# EAGLE design UV_exposure_v1.0 (EAGLE 7.5.0)
Circuit for UV exposure unit.
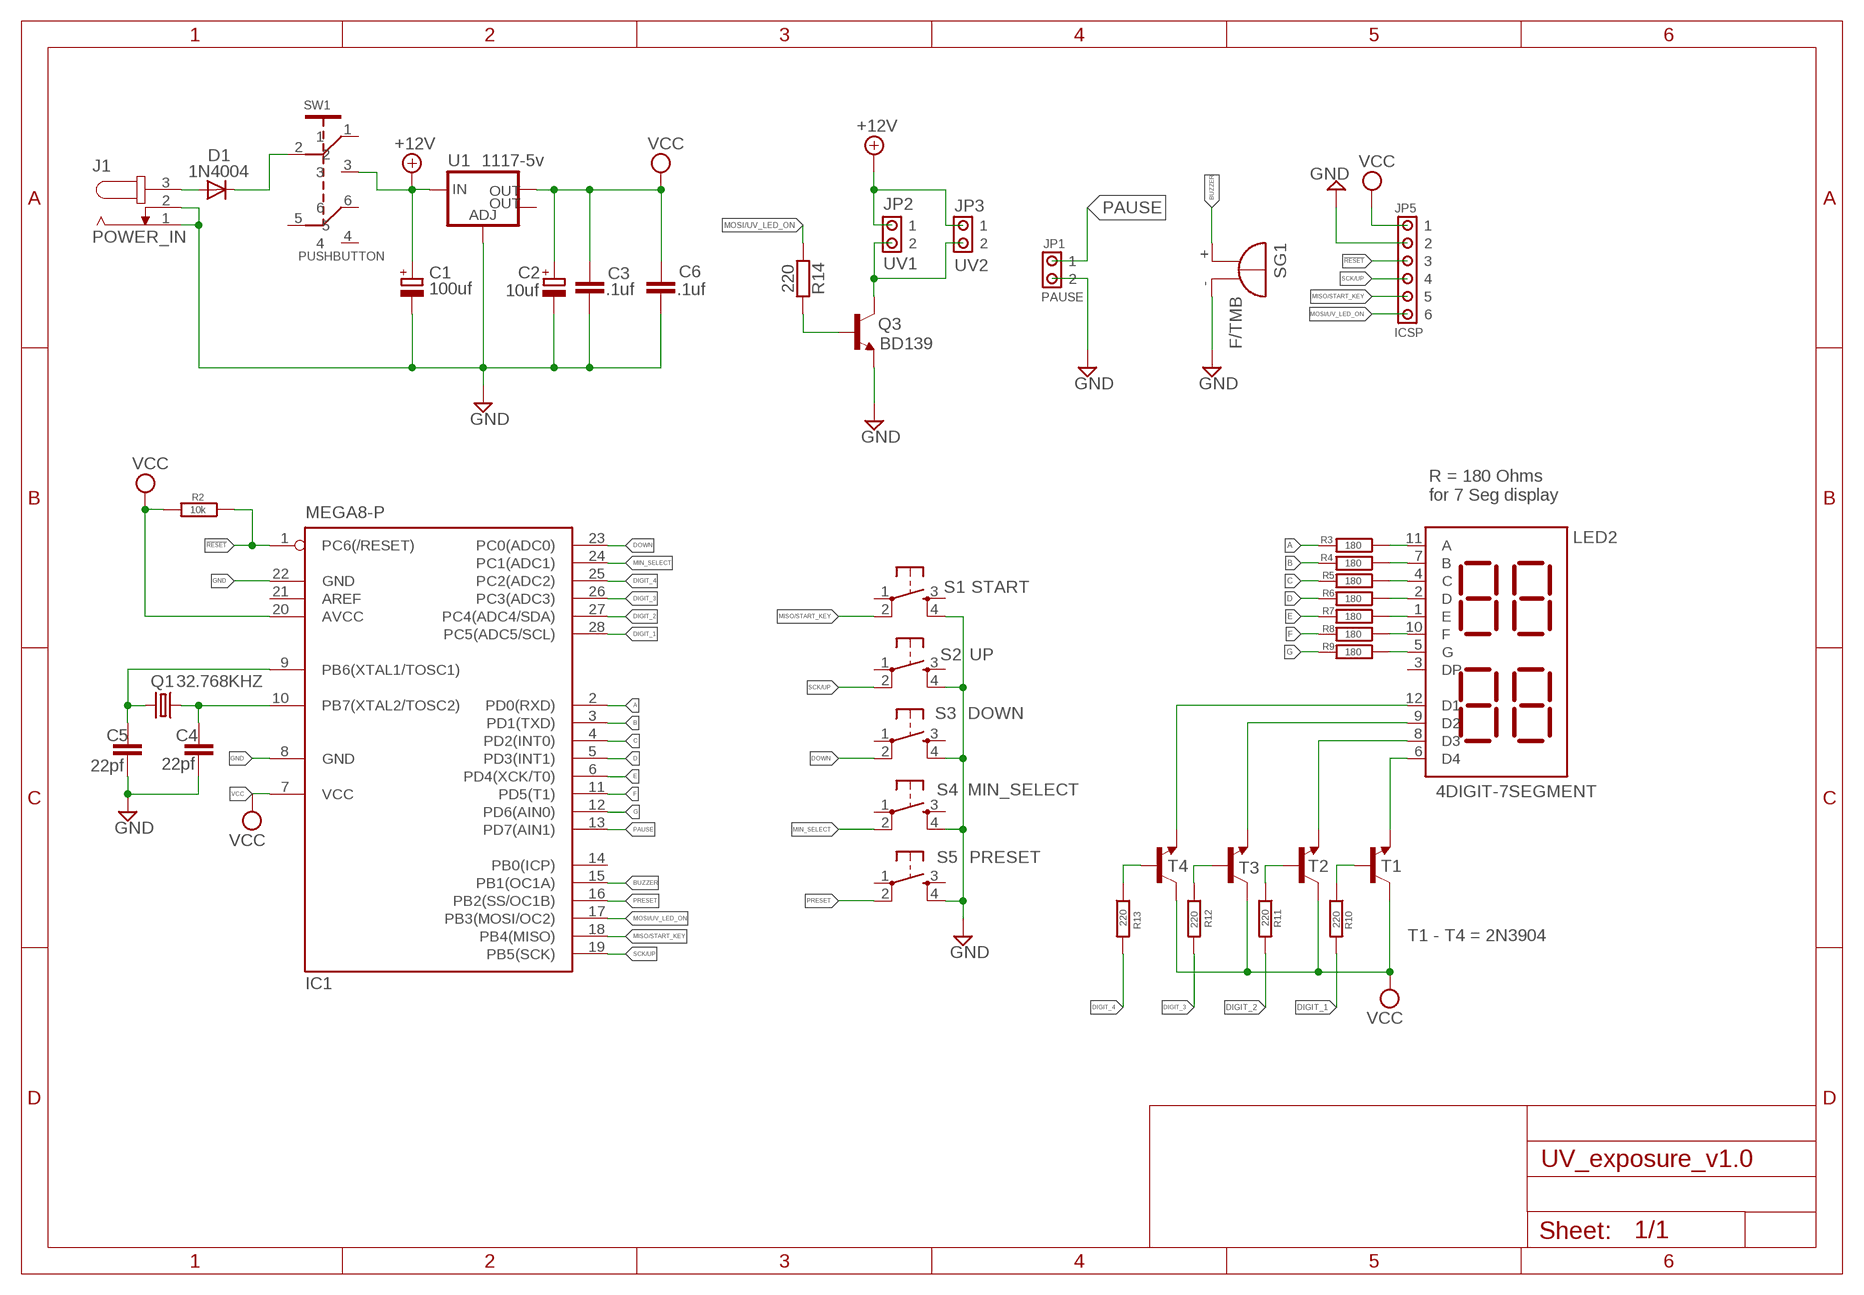
[diagram p0: schematic, sheet 1]

## Parts
C1  100uf  CPOL-EUUD-6,3X7,7  [UD-6,3X7,7_NICHICON]
C2  10uf  CPOL-EU153CLV-0505  [153CLV-0505]
C3  .1uf  C-EUC0805  [C0805]
C4  22pf  C-EUC0805  [C0805]
C5  22pf  C-EUC0805  [C0805]
C6  .1uf  C-EUC0805  [C0805]
D1  1N4004  DIODE-DO214AA  [DO214AA]
IC1  MEGA8-P  [DIL28-3]
J1  POWER_IN  JACK-PLUG1  [SPC4078]
JP1  PAUSE  PIN_HDR_2X1::LONG  [1X2_LONG]
JP2  UV1  PIN_HDR_2X1::LONG  [1X2_LONG]
JP3  UV2  PIN_HDR_2X1::LONG  [1X2_LONG]
JP5  ICSP  PIN_HDR_6X1  [1X6_LONG]
LED2  4DIGIT-7SEGMENT  [4DIGIT-7SEGMENT]
Q1  32.768KHZ  CRYSTALTC26V  [TC26V]
Q3  BD139  [TO126]
R2  10k  R-EU_R1206W  [R1206W]
R3  180  R-EU_R1206W  [R1206W]
R4  180  R-EU_R1206W  [R1206W]
R5  180  R-EU_R1206W  [R1206W]
R6  180  R-EU_R1206W  [R1206W]
R7  180  R-EU_R1206W  [R1206W]
R8  180  R-EU_R1206W  [R1206W]
R9  180  R-EU_R1206W  [R1206W]
R10  220  R-EU_R1206W  [R1206W]
R11  220  R-EU_R1206W  [R1206W]
R12  220  R-EU_R1206W  [R1206W]
R13  220  R-EU_R1206W  [R1206W]
R14  220  R-EU_R1206W  [R1206W]
S1  START  10-XX-SWITCH  [B3F-10XX]
S2  UP  10-XX-SWITCH  [B3F-10XX]
S3  DOWN  10-XX-SWITCH  [B3F-10XX]
S4  MIN_SELECT  10-XX-SWITCH  [B3F-10XX]
S5  PRESET  10-XX-SWITCH  [B3F-10XX]
SG1  F/TMB  [F/TMB]
SW1  PUSHBUTTON  [SPDT-6PIN]
T1  2N3904  MMBT3904LT1-NPN-SOT23-BEC  [SOT23-BEC]
T2  2N3904  MMBT3904LT1-NPN-SOT23-BEC  [SOT23-BEC]
T3  2N3904  MMBT3904LT1-NPN-SOT23-BEC  [SOT23-BEC]
T4  2N3904  MMBT3904LT1-NPN-SOT23-BEC  [SOT23-BEC]
U1  1117-5v  V_REG_LM1117SOT223  [SOT223]

## Nets
!RESET: IC1.1(PC6(/RESET)) JP5.3 R2.1
+12V: C1.+ JP2.1 JP3.1 SW1.3 U1.3(IN)
A: IC1.2(PD0(RXD)) R3.2
B: IC1.3(PD1(TXD)) R4.2
BUZZER: IC1.15(PB1(OC1A)) SG1.+
C: IC1.4(PD2(INT0)) R5.2
D: IC1.5(PD3(INT1)) R6.2
DIGIT_1: IC1.28(PC5(ADC5/SCL)) R10.2
DIGIT_2: IC1.27(PC4(ADC4/SDA)) R11.2
DIGIT_3: IC1.26(PC3(ADC3)) R12.2
DIGIT_4: IC1.25(PC2(ADC2)) R13.2
DOWN: IC1.23(PC0(ADC0)) S3.2(P1)
E: IC1.6(PD4(XCK/T0)) R7.2
F: IC1.11(PD5(T1)) R8.2
G: IC1.12(PD6(AIN0)) R9.2
GND: C1.- C2.- C3.2 C4.2 C5.2 C6.2 IC1.8(GND) IC1.22(GND) J1.1 J1.2 JP1.2 JP5.2 Q3.1(E) S1.4(S1) S2.4(S1) S3.4(S1) S4.4(S1) S5.4(S1) SG1.- U1.1(ADJ)
MIN_SELECT: IC1.24(PC1(ADC1)) S4.2(P1)
MISO/START_KEY: IC1.18(PB4(MISO)) JP5.5 S1.2(P1)
MOSI/UV_LED_ON: IC1.17(PB3(MOSI/OC2)) JP5.6 R14.2
N$2: D1.A J1.3
N$3: C4.1 IC1.10(PB7(XTAL2/TOSC2)) Q1.1
N$4: D1.C SW1.2
N$5: C5.1 IC1.9(PB6(XTAL1/TOSC1)) Q1.2
N$6: LED2.11(A) R3.1
N$7: LED2.7(B) R4.1
N$8: LED2.4(C) R5.1
N$9: LED2.2(D) R6.1
N$10: LED2.1(E) R7.1
N$11: LED2.10(F) R8.1
N$12: LED2.5(G) R9.1
N$13: LED2.6(D4) T1.E
N$14: R10.1 T1.B
N$15: LED2.8(D3) T2.E
N$16: LED2.9(D2) T3.E
N$17: LED2.12(D1) T4.E
N$18: R13.1 T4.B
N$19: R12.1 T3.B
N$20: R11.1 T2.B
N$21: Q3.3(B) R14.1
N$23: JP2.2 JP3.2 Q3.2(C)
PAUSE: IC1.13(PD7(AIN1)) JP1.1
PRESET: IC1.16(PB2(SS/OC1B)) S5.2(P1)
SCK/UP: IC1.19(PB5(SCK)) JP5.4 S2.2(P1)
VCC: C2.+ C3.1 C6.1 IC1.7(VCC) IC1.20(AVCC) JP5.1 R2.2 T1.C T2.C T3.C T4.C U1.2(OUT)
Unconnected: IC1.14(PB0(ICP)) IC1.21(AREF) LED2.3(DP) S1.1(P) S1.3(S) S2.1(P) S2.3(S) S3.1(P) S3.3(S) S4.1(P) S4.3(S) S5.1(P) S5.3(S) SW1.1 SW1.4 SW1.5 SW1.6 U1.4(OUT)

## Notes on the sheet
- R = 180 Ohms
  for 7 Seg display
- T1 - T4 = 2N3904

## Library data of the parts
C1 C2 = rcl:CPOL-EU: POLARIZED CAPACITOR, European symbol
C3-C6 = rcl:C-EU: CAPACITOR, European symbol
D1 = diode:DIODE-: DIODE
IC1 = atmel:MEGA8-P: MICROCONTROLLER 8 Kbytes FLASH, 1 kbytes SRAM, 512 bytes EEPROM, USART, 4-channel 10 bit ADC, 2-channel 8 bit ADC Pin compatible with Atmega48, ATMega88, ATMega168 Source: avr.lbr; OC_FARNELL: unknown; OC_NEWARK: unknown
J1 = con-jack:JACK-PLUG: DC POWER JACK Power Jack, DC, Right Angle, Through Hole, Rated 5A at 16VDC, PC Terminals Distributor: Farnell (www.Farnell.de) Drawing: 84N1161.pdf / 84N1162.pdf Manufacturer: SPC Technology (www.spctechnology.com) Type: SPC4077 / SPC 4078; OC_FARNELL: unknown; OC_NEWARK: unknown
JP1-JP3 = pinheaders:PIN_HDR_2X1: 2x1 pin header with different pad shapes.
JP5 = pinheaders:PIN_HDR_6X1
LED2 = mylib_v10:4DIGIT-7SEGMENT
Q1 = crystal:CRYSTAL: CRYSTAL; OC_FARNELL: unknown; OC_NEWARK: unknown
Q3 = transistor-npn:BD139*: NPN Transistor
R2-R14 = rcl:R-EU_: RESISTOR, European symbol
S1-S5 = my_library:10-XX-SWITCH: OMRON SWITCH
SG1 = buzzer:F/TMB: BUZZER Source: Buerklin; OC_FARNELL: unknown; OC_NEWARK: unknown
SW1 = switches:PUSHBUTTON
T1-T4 = transistor:*-NPN-: NPN Transistror BF959 corrected 2008.03.06
U1 = SparkFun-PowerIC:V_REG_LM1117: Voltage Regulator LM1117 Standard adjustable voltage regulator but in SMD form. Spark Fun Electronics SKU : COM-00595; PROD_ID: VREG-08170

## Net classes
0 default: width 0.406 mm, drill 0.6 mm, clearance 0.254 mm

## Board
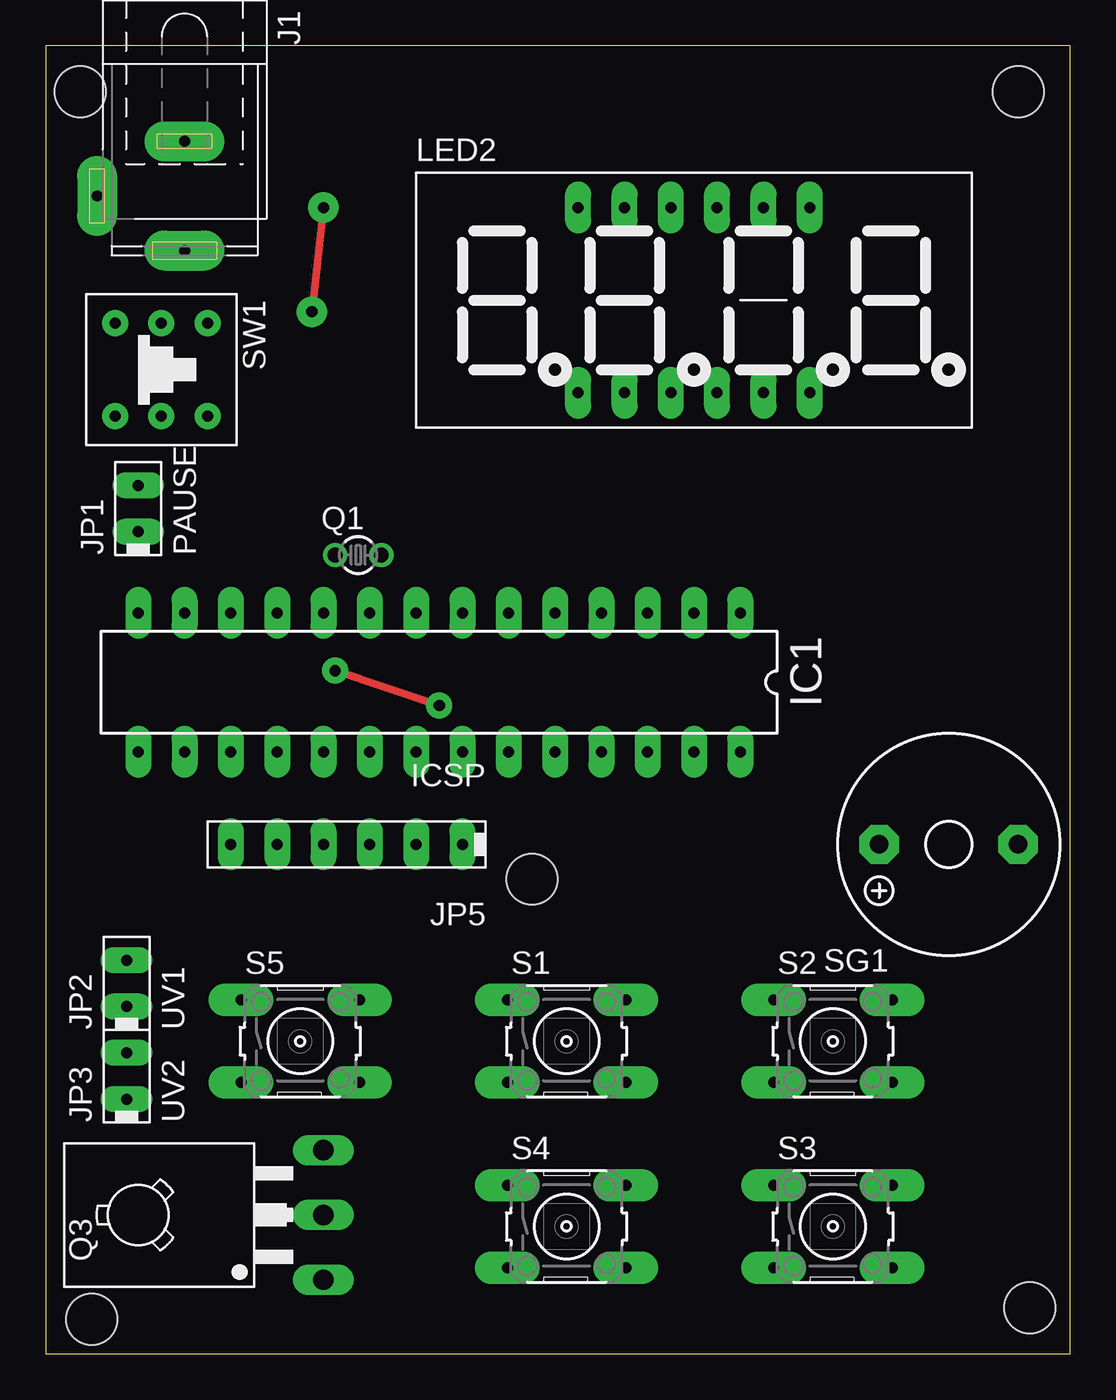
[diagram p1: board, top side]
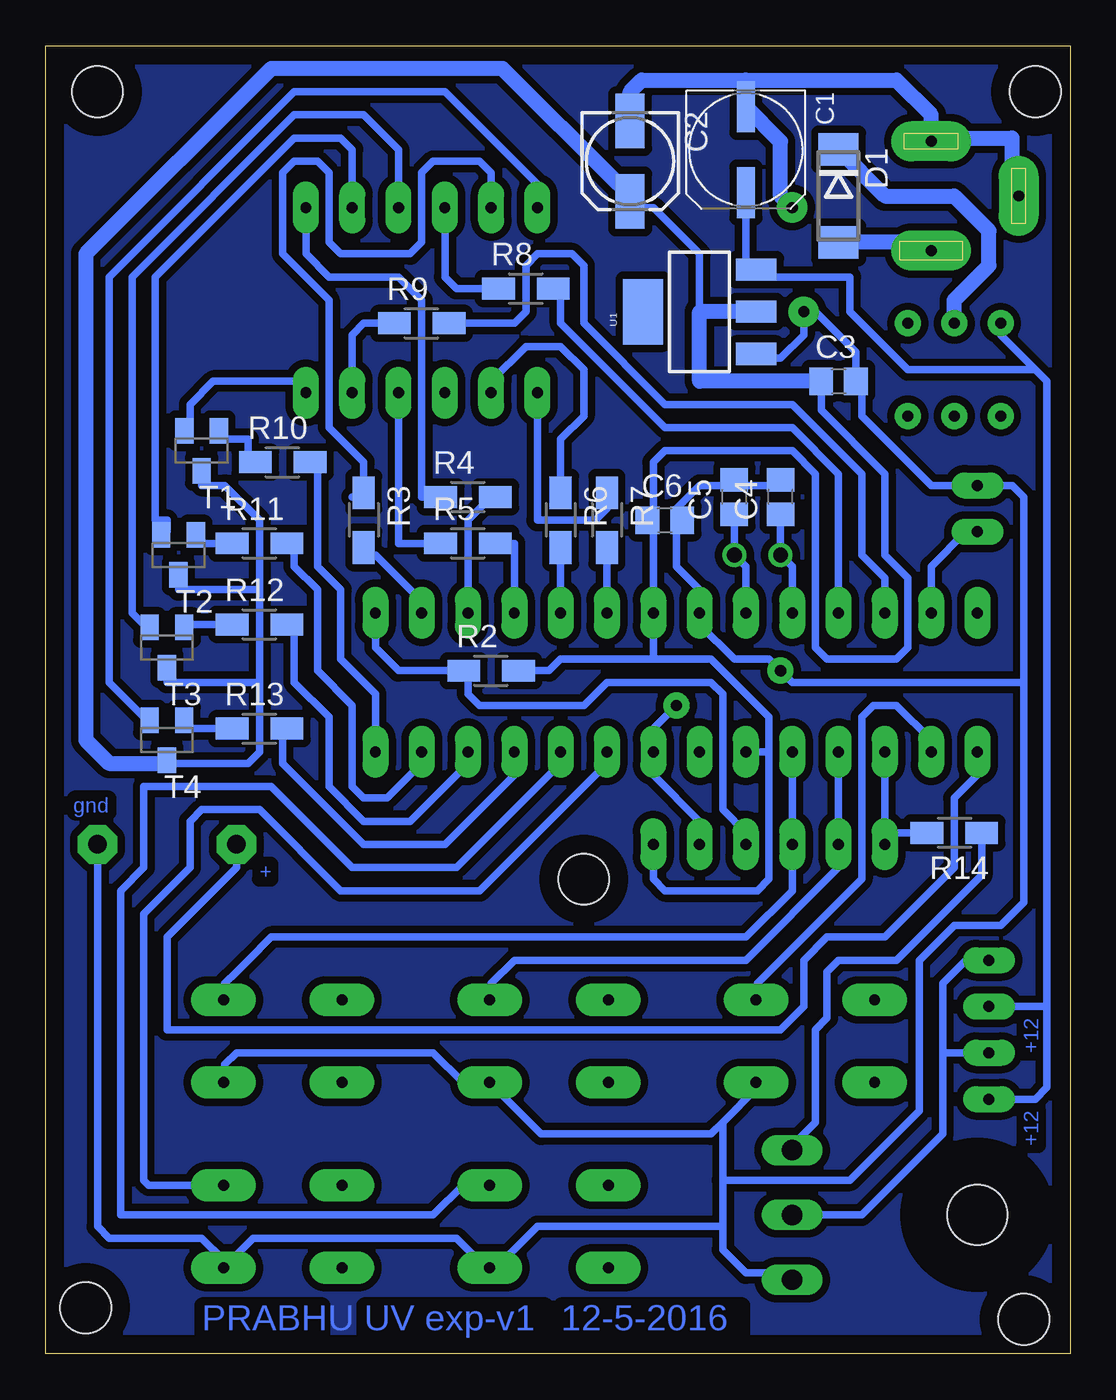
[diagram p2: board, bottom side, seen from below]

Size 56.19 x 71.75 mm. Coordinates in mm from the lower left corner, seen from the top.
Outline: 0,0 56.19,0 56.19,71.75 0,71.75 0,0
Copper layers (1*16): Top 0.035mm / dielectric 1.5mm / Bottom 0.035mm
Design rules "default *": minimum track width 10mil, minimum drill 0.6mm, track to track 8mil, track to pad 8mil, pad to pad 8mil, via to via 8mil, smd to smd 8mil, copper to edge 40mil, drill to drill 8mil, minimum pad ring 10mil, minimum via ring 8mil, stop-mask expansion 4mil, vias tented up to drill 0mil, thermal gap 10mil
Holes 2.8 mm at 26.67,26.04 53.98,2.54 2.54,1.91 53.34,69.22 1.91,69.22

### Footprints (pad centres in the part's own frame; a part is rotated, then mirrored left to right if it is on the bottom)
UD-6,3X7,7_NICHICON = smd 2.8 x 1: + 2.35,0; - -2.35,0
153CLV-0505 = smd 3 x 1.6: + 2.2,0; - -2.2,0
C0805 = smd 1.3 x 1.5: 1 -0.95,0; 2 0.95,0
DO214AA = smd 1.8 x 2.2: A 2.55,0; C -2.55,0
DIL28-3 = drill 0.6 pad 1.422 long: 1 -16.51,-3.81; 2 -13.97,-3.81; 3 -11.43,-3.81; 4 -8.89,-3.81; 5 -6.35,-3.81; 6 -3.81,-3.81; 7 -1.27,-3.81; 8 1.27,-3.81; 9 3.81,-3.81; 10 6.35,-3.81; 11 8.89,-3.81; 12 11.43,-3.81; 13 13.97,-3.81; 14 16.51,-3.81; 15 16.51,3.81; 16 13.97,3.81; 17 11.43,3.81; 18 8.89,3.81; 19 6.35,3.81; 20 3.81,3.81; 21 1.27,3.81; 22 -1.27,3.81; 23 -3.81,3.81; 24 -6.35,3.81; 25 -8.89,3.81; 26 -11.43,3.81; 27 -13.97,3.81; 28 -16.51,3.81
SPC4078 = drill 0.6 pad 2.184 long: 1 -3,0; 2 0,-4.8; 3 3,0
1X2_LONG = drill 0.6 pad 1.422 long: 1 0,0; 2 2.54,0
1X6_LONG = drill 0.6 pad 1.422 long: 1 -5.08,0; 2 -2.54,0; 3 0,0; 4 2.54,0; 5 5.08,0; 6 7.62,0
4DIGIT-7SEGMENT = drill 0.6 pad 1.422 long: 1 -6.35,-5.08; 2 -3.81,-5.08; 3 -1.27,-5.08; 4 1.27,-5.08; 5 3.81,-5.08; 6 6.35,-5.08; 7 6.35,5.08; 8 3.81,5.08; 9 1.27,5.08; 10 -1.27,5.08; 11 -3.81,5.08; 12 -6.35,5.08
TC26V = drill 0.813: 1 -1.27,0; 2 1.27,0
TO126 = drill 1.118 pad 1.422 long: 1 -3.556,-5.08; 2 0,-5.08; 3 3.556,-5.08 | hole 3.302: 0,5.08
R1206W = smd 1.8 x 1.2: 1 -1.499,0; 2 1.499,0
B3F-10XX = drill 0.6 pad 1.778 long: 1 -3.251,2.261; 2 3.251,2.261; 3 -3.251,-2.261; 4 3.251,-2.261
F/TMB = drill 1.016 pad 2.159 octagon: + 3.81,0; - -3.81,0
SPDT-6PIN = drill 0.6 pad 1.422: 1 -2.54,2.54; 2 -2.54,0; 3 -2.54,-2.54; 4 2.54,-2.54; 5 2.54,0; 6 2.54,2.54
SOT23-BEC = smd 1 x 1.4: B -0.95,-1.1; C 0,1.1; E 0.95,-1.1
SOT223 = smd 1.219 x 2.235: 1 -2.311,-3.099; 2 0,-3.099; 3 2.311,-3.099 | smd 3.6 x 2.2: 4 0,3.099

### Placement (x,y rotation side)
C1  17.78,66.04 270 bottom
C2  24.13,65.41 270 bottom
C3  12.7,53.34 0 bottom
C4  15.88,46.99 90 bottom
C5  18.41,46.99 90 bottom
C6  22.23,45.72 0 bottom
D1  12.7,63.5 270 bottom
IC1  21.59,36.83 180 top
J1  7.62,63.5 270 top
JP1  5.08,45.09 90 top
JP2  4.45,19.05 90 top
JP3  4.45,13.97 90 top
JP5  17.78,27.94 180 top
LED2  35.56,57.78 0 top
Q1  17.14,43.81 0 top
Q3  10.16,7.62 90 top
R2  31.75,37.47 0 bottom
R3  38.73,45.72 270 bottom
R4  33.02,46.99 0 bottom
R5  33.02,44.45 0 bottom
R6  27.94,45.72 270 bottom
R7  25.4,45.72 270 bottom
R8  29.84,58.42 0 bottom
R9  35.56,56.52 0 bottom
R10  43.18,48.9 0 bottom
R11  44.45,44.45 0 bottom
R12  44.45,40.01 0 bottom
R13  44.45,34.29 0 bottom
R14  6.35,28.57 180 bottom
S1  28.57,17.14 0 top
S2  43.18,17.14 0 top
S3  43.18,6.99 0 top
S4  28.57,6.99 0 top
S5  13.97,17.14 0 top
SG1  49.53,27.94 180 top
SW1  6.35,53.98 270 top
T1  47.62,49.53 180 bottom
T2  48.9,43.81 180 bottom
T3  49.53,38.73 180 bottom
T4  49.53,33.66 180 bottom
U1  20.32,57.15 90 bottom

### Tracks (layer width: path | path; a pad name or v marks a point on that pad's centre or on a via)
!RESET
  Bottom 0.406: JP5.3 17.78,28.57 19.05,29.84 19.05,36.2 19.68,36.83 25.4,36.83 26.67,35.56 32.38,35.56 33.02,36.2 33.02,37.24 R2.1 | IC1.1 38.1,38.73 36.83,37.47 R2.1 | 33.02,37.47 R2.1
+12V
  Bottom 0.406: 1.91,53.98 3.81,55.88 SW1.3 | 1.27,19.05 1.27,14.61 1.91,13.97 JP3.1 | 1.27,19.05 1.27,53.34 1.59,53.66 1.91,53.98 | 17.59,63.5 C1.+ 17.78,59.69 U1.3 | 17.14,59.69 U1.3 | U1.3 16.82,59.05 12.06,59.05 12.06,57.15 8.89,53.98 1.91,53.98 | JP2.1 1.27,19.05
A
  Bottom 0.406: IC1.2 35.56,41.27 38.1,43.81 38.73,43.81 R3.2
B
  Bottom 0.406: IC1.3 33.02,45.72 31.75,46.99 R4.2
BUZZER
  Bottom 0.406: SG1.+ 45.72,26.67 49.53,22.86 49.53,17.78 15.88,17.78 14.61,19.05 14.61,21.59 13.34,22.86 10.16,22.86 6.35,26.67 6.35,30.48 5.08,31.75 IC1.15
C
  Bottom 0.406: R5.2 30.48,44.45 IC1.4
D
  Bottom 0.406: IC1.5 R6.2
DIGIT_1
  Bottom 0.406: IC1.28 38.1,36.2 40.01,38.1 40.01,41.91 41.27,43.18 41.27,48.9 R10.2
DIGIT_2
  Bottom 0.406: R11.2 42.55,44.45 42.55,43.18 41.27,41.91 41.27,37.47 39.37,35.56 39.37,31.11 38.73,30.48 37.47,30.48 35.56,32.38 IC1.27
DIGIT_3
  Bottom 0.406: IC1.26 33.02,32.38 36.2,29.21 38.73,29.21 40.64,31.11 40.64,34.92 42.55,36.83 42.55,40.01 R12.2
DIGIT_4
  Bottom 0.406: IC1.25 30.48,31.75 34.29,27.94 38.73,27.94 43.18,32.38 43.18,34.06 R13.2
DOWN
  Bottom 0.406: IC1.23 25.4,32.38 32.38,25.4 40.01,25.4 44.45,29.84 47.62,29.84 48.26,29.21 48.26,26.67 50.8,24.13 50.8,9.53 50.52,9.25 S3.2
E
  Bottom 0.406: IC1.6 R7.2
F
  Bottom 0.406: IC1.11 12.7,48.26 15.24,50.8 22.23,50.8 27.94,56.52 27.94,58.42 R8.2
G
  Bottom 0.406: R9.2 30.48,56.52 29.84,57.15 29.84,59.69 29.21,60.33 27.3,60.33 26.67,59.69 26.67,56.52 22.23,52.07 15.24,52.07 11.43,48.26 11.43,43.81 10.16,42.55 IC1.12
GND  (via drill 0.61 pad 1.42, 0.61 pad 1.68)
  Top 0.406: v21.59,35.56 v15.88,37.47 | v14.61,57.15 v15.24,62.87
  Bottom 0.406: 19.05,12.7 17.14,14.61 S5.4 | 19.05,12.7 19.68,12.06 29.01,12.06 S1.4 33.3,14.88 34.92,16.51 45.72,16.51 46.35,15.88 46.35,14.96 S2.4 | Q3.1 15.24,4.45 17.78,4.45 19.05,5.71 19.05,6.99 | 19.05,12.7 19.05,9.53 | 19.05,9.53 19.05,6.99 | 19.05,9.53 12.06,9.53 8.26,13.34 8.26,21.59 6.35,23.5 3.81,23.5 2.54,24.77 2.54,36.83 | 2.54,36.83 2.54,46.99 3.17,47.62 JP1.2 7.62,47.62 11.43,51.44 11.43,53.02 C3.2 11.75,54.93 13.97,57.15 v14.61,57.15 14.61,55.88 15.88,54.61 16.99,54.61 U1.1 17.14,54.61 | JP5.2 20.32,29.21 22.86,31.75 IC1.22 22.86,34.29 v21.59,35.56 | 3.17,63.5 J1.2 | 7.62,66.67 J1.1 | C1.- 17.78,69.85 | 2.54,36.83 15.24,36.83 v15.88,37.47 16.51,38.1 18.41,38.1 20.32,40.01 IC1.8 20.32,41.91 21.59,43.18 21.59,45.72 | 21.59,45.72 21.59,46.35 20.32,47.62 18.41,47.62 | 21.59,45.72 C6.2 | 18.41,47.62 C5.2 | 18.41,47.62 15.88,47.62 C4.2 | SG1.- 53.34,6.99 52.7,6.35 47.62,6.35 46.43,5.16 S3.4 | 46.35,4.65 S3.4 | 19.05,6.99 29.21,6.99 31.47,4.72 S4.4 32.03,4.72 33.66,6.35 44.81,6.35 S3.4
  Bottom 0.813: 3.17,63.5 3.17,66.67 7.62,66.67 7.62,67.94 9.53,69.85 17.78,69.85 23.5,69.85 24.13,69.22 C2.- | v15.24,62.87 15.88,63.5 15.88,66.48 C1.-
MIN_SELECT
  Bottom 0.406: IC1.24 27.94,32.38 33.66,26.67 39.37,26.67 43.81,31.11 50.8,31.11 50.8,26.67 52.07,25.4 52.07,7.62 34.92,7.62 33.3,9.25 S4.2
MISO/START_KEY
  Bottom 0.406: IC1.18 JP5.5 12.7,26.67 17.78,21.59 30.48,21.59 31.75,20.32 31.75,19.48 S1.2
MOSI/UV_LED_ON
  Bottom 0.406: JP5.6 10.16,28.57 | 10.16,28.57 IC1.17 | R14.2 10.16,28.57
N$1
  pour Bottom (isolate 0.406): 0,0 55.88,0 55.88,71.75 0,71.75
N$2
  Bottom 0.406: D1.A
  Bottom 0.813: D1.A 7.62,60.96 J1.3
N$3
  Bottom 0.406: IC1.10 15.24,43.18 Q1.1 C4.1
N$4
  Bottom 0.406: D1.C
  Bottom 0.813: SW1.2 6.35,57.78 4.45,59.69 4.45,61.59 6.35,63.5 10.15,63.5 D1.C
N$5
  Bottom 0.406: IC1.9 17.78,43.18 Q1.2 C5.1
N$6
  Bottom 0.406: 31.75,63.5 LED2.11 31.75,64.77 32.38,65.41 34.92,65.41 35.56,64.77 35.56,60.96 36.2,60.33 40.01,60.33 40.64,60.96 40.64,64.77 41.27,65.41 42.55,65.41 43.18,64.77 43.18,60.33 40.64,57.78 40.64,50.8 38.73,48.9 R3.1 39.37,46.99
N$7
  Bottom 0.406: LED2.7 41.91,60.33 40.64,59.05 36.83,59.05 35.56,57.78 35.56,46.99 R4.1
N$8
  Bottom 0.406: R5.1 36.83,44.45 LED2.4
N$9
  Bottom 0.406: LED2.2 31.75,53.34 29.84,55.24 27.94,55.24 26.67,53.98 26.67,51.44 27.94,50.16 R6.1
N$10
  Bottom 0.406: R7.1 25.4,46.35 26.04,45.72 29.21,45.72 LED2.1
N$11
  Bottom 0.406: R8.1 33.66,58.42 34.29,59.05 LED2.10
N$12
  Bottom 0.406: LED2.5 39.37,55.88 38.73,56.52 R9.1
N$13
  Bottom 0.406: LED2.6 41.91,53.34 46.99,53.34 48.26,52.07 48.26,50.8 T1.E
N$14
  Bottom 0.406: T1.B 46.35,50.16 45.09,50.16 45.09,48.9 R10.1
N$15
  Bottom 0.406: LED2.8 39.37,66.04 40.01,66.67 42.55,66.67 50.16,59.05 50.16,45.72 49.53,45.72 49.53,45.09 T2.E
N$16
  Bottom 0.406: 36.83,63.5 LED2.9 36.83,66.04 38.73,67.94 42.55,67.94 51.44,59.05 51.44,40.64 50.8,40.01 T3.E
N$17
  Bottom 0.406: LED2.12 29.21,64.14 34.29,69.22 42.55,69.22 52.7,59.05 52.7,36.83 50.8,34.92 T4.E
N$18
  Bottom 0.406: R13.1 48.26,34.29 T4.B
N$19
  Bottom 0.406: R12.1 48.26,40.01 T3.B
N$20
  Bottom 0.406: R11.1 47.62,44.45 T2.B
N$21
  Bottom 0.406: Q3.3 15.24,11.43 13.97,12.7 13.97,17.78 13.34,18.41 13.34,20.95 12.7,21.59 9.53,21.59 4.85,26.26 R14.1
N$23
  Bottom 0.406: Q3.2 11.43,7.62 6.99,12.06 6.99,16.51 | 6.99,16.51 6.99,20.32 5.71,21.59 JP2.2 | JP3.2 6.99,16.51
PAUSE
  Bottom 0.406: JP1.1 5.71,45.09 7.62,43.18 IC1.13
PRESET
  Bottom 0.406: IC1.16 7.62,33.66 9.53,35.56 10.79,35.56 11.43,34.92 11.43,26.04 17.14,20.32 17.14,19.48 S5.2
SCK/UP
  Bottom 0.406: IC1.19 JP5.4 15.24,25.4 17.78,22.86 43.81,22.86 45.09,21.59 45.72,20.95 46.35,20.32 46.35,19.48 S2.2
VCC
  Bottom 0.406: 24.77,64.14 24.13,64.14 C2.+ 23.79,62.87 22.86,62.87 20.32,60.33 20.32,57.15 | 44.45,41.91 44.45,45.72 46.35,47.62 47.62,47.62 T1.C | 44.45,41.91 44.45,36.83 | T2.C 48.9,41.91 44.45,41.91 | T3.C 49.53,36.83 44.45,36.83 | 44.45,36.83 44.45,33.02 45.09,32.38 49.53,32.38 T4.C 49.53,33.02 | 16.51,33.02 16.51,34.92 19.68,38.1 22.86,38.1 | 16.51,33.02 16.51,26.04 17.14,25.4 22.23,25.4 22.86,26.04 JP5.1 | 22.86,46.03 IC1.7 22.86,38.1 | 22.86,38.1 27.94,38.1 28.57,37.47 R2.2 | C3.1 13.65,51.75 10.16,48.26 10.16,43.81 8.89,42.55 8.89,38.73 9.53,38.1 13.34,38.1 13.97,38.73 13.97,48.26 15.24,49.53 22.23,49.53 22.86,48.9 22.86,46.03 | 22.86,46.03 C6.1 | IC1.20 16.51,33.02
  Bottom 0.813: C3.1 20.32,53.34 20.32,57.15 U1.2 | 24.77,64.14 31.11,70.48 43.81,70.48 53.98,60.33 53.98,33.66 52.7,32.38 49.7,32.38 T4.C

### Text on the board
Bottom: gnd | + | +12 | +12 | 12-5-2016 | UV exp-v1 | PRABHU